# EAGLE schematic tx-slim-2.4g (EAGLE 9.6.2)
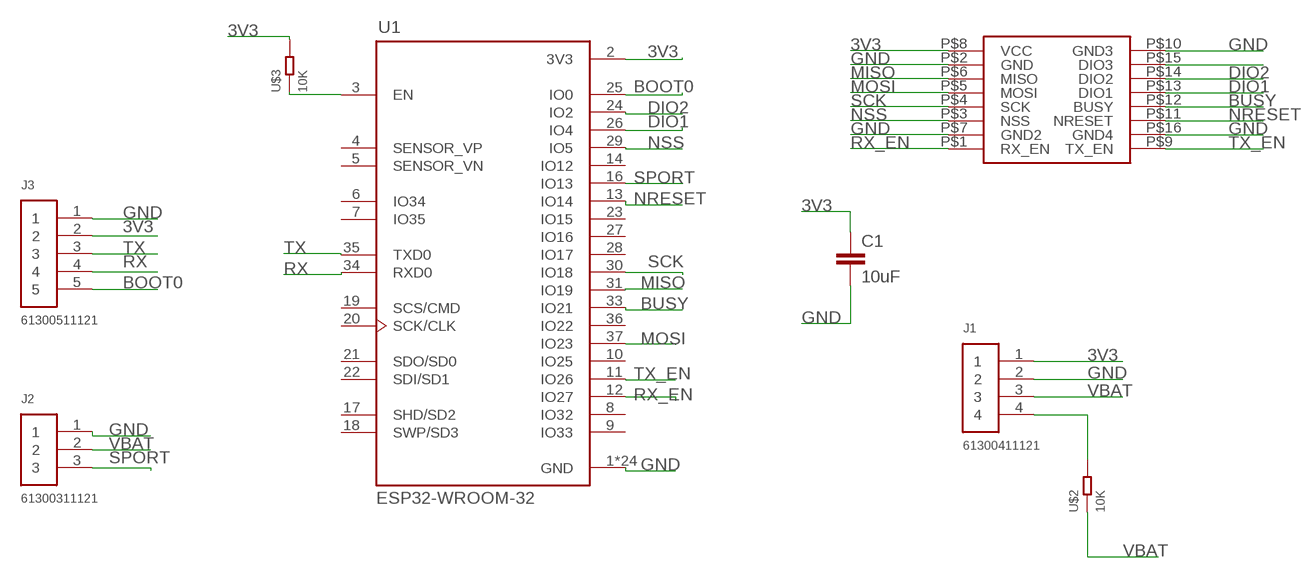
[diagram p0: schematic, sheet 1]

## Parts
C1  10uF  10UF-1210-50V-20%  [1210]
J1  61300411121  [61300411121]
J2  61300311121  [61300311121]
J3  61300511121  [61300511121]
U1  ESP32-WROOM-32  [MODULE_ESP32-WROOM-32]
U$1  E28  [E28]
U$2  10K  SMD-RES-10K-1%-1/8W(0805)  [R0805]
U$3  10K  SMD-RES-10K-1%-1/8W(0805)  [R0805]

## Nets
3V3: C1.1 J1.1 J3.2 U1.2(3V3) U$1.P$8(VCC) U$3.2
BOOT0: J3.5 U1.25(IO0)
BUSY: U1.33(IO21) U$1.P$12(BUSY)
DIO1: U1.26(IO4) U$1.P$13(DIO1)
DIO2: U1.24(IO2) U$1.P$14(DIO2)
GND: C1.2 J1.2 J2.1 J3.1 U1.1(GND) U1.15(GND) U1.38(GND) U1.39_1(GND) U1.39_2(GND) U1.39_3(GND) U1.39_4(GND) U1.39_5(GND) U1.39_6(GND) U1.39_7(GND) U1.39_8(GND) U1.39_9(GND) U1.39_10(GND) U1.39_11(GND) U1.39_12(GND) U1.39_13(GND) U1.39_14(GND) U1.39_15(GND) U1.39_16(GND) U1.39_17(GND) U1.39_18(GND) U1.39_19(GND) U1.39_20(GND) U1.39_21(GND) U$1.P$2(GND) U$1.P$7(GND2) U$1.P$10(GND3) U$1.P$16(GND4)
MISO: U1.31(IO19) U$1.P$6(MISO)
MOSI: U1.37(IO23) U$1.P$5(MOSI)
N$4: J1.4 U$2.2
N$5: U1.3(EN) U$3.1
N$11: U$1.P$15(DIO3)
NRESET: U1.13(IO14) U$1.P$11(NRESET)
NSS: U1.29(IO5) U$1.P$3(NSS)
RX: J3.4 U1.34(RXD0)
RX_EN: U1.12(IO27) U$1.P$1(RX_EN)
SCK: U1.30(IO18) U$1.P$4(SCK)
SPORT: J2.3 U1.16(IO13)
TX: J3.3 U1.35(TXD0)
TX_EN: U1.11(IO26) U$1.P$9(TX_EN)
VBAT: J1.3 J2.2 U$2.1
Unconnected: U1.4(SENSOR_VP) U1.5(SENSOR_VN) U1.6(IO34) U1.7(IO35) U1.8(IO32) U1.9(IO33) U1.10(IO25) U1.14(IO12) U1.17(SHD/SD2) U1.18(SWP/SD3) U1.19(SCS/CMD) U1.20(SCK/CLK) U1.21(SDO/SD0) U1.22(SDI/SD1) U1.23(IO15) U1.27(IO16) U1.28(IO17) U1.36(IO22)

## Library data of the parts
C1 = SparkFun-Capacitors:10UF: 10.0µF ceramic capacitors A capacitor is a passive two-terminal electrical component used to store electrical energy temporarily in an electric field.; PROD_ID: CAP-09824
J1 = Headers:61300411121: CONN HEADER VERT 4POS 2.54MM Manufacturer's datasheet <https://katalog.we-online.de/em/datasheet/6130xx11121.pdf>; CREATED_BY: PCBLayout.com; DIGI_KEY_PART_NUMBER: 732-5317-ND; MANUFACTURER: Wurth Electronics Inc.; MPN: 61300411121
J2 = Headers:61300311121: CONN HEADER VERT 3POS 2.54MM Manufacturer's datasheet <https://katalog.we-online.de/em/datasheet/6130xx11121.pdf>; CREATED_BY: PCBLayout.com; DIGI_KEY_PART_NUMBER: 732-5316-ND; MANUFACTURER: Wurth Electronics Inc.; MPN: 61300311121
J3 = Headers:61300511121: CONN HEADER VERT 5POS 2.54MM Manufacturer's datasheet <https://katalog.we-online.de/em/datasheet/6130xx11121.pdf>; CREATED_BY: PCBLayout.com; DIGI_KEY_PART_NUMBER: 732-5318-ND; MANUFACTURER: Wurth Electronics Inc.; MPN: 61300511121
U1 = ESP32-WROOM-32:ESP32-WROOM-32: Bluetooth, WiFi Transceiver Module 2.4GHz ~ 2.5GHz Surface Mount Check prices <https://snapeda.com/parts/ESP32-WROOM-32/Espressif%20Systems/view-part/?ref=eda>; AVAILABILITY: Warning; DESCRIPTION: Bluetooth, WiFi Transceiver Module 2.4GHz ~ 2.5GHz Surface Mount; DIGIKEY-PURCHASE-URL: https://snapeda.com/shop?store=DigiKey&id=2753322; MF: Espressif Systems; MP: ESP32-WROOM-32; PACKAGE: Module Espressif Systems; PRICE: None
U$1 = e28:E28
U$2 U$3 = OPL_Resistor:SMD-RES-10K-1%-1/8W(0805): 301012152; MPN: RC0805FR-0710KL